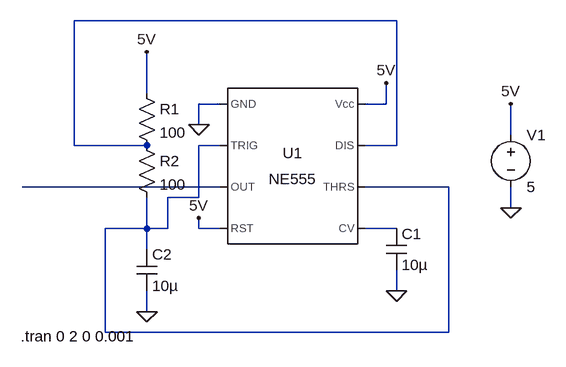
[diagram p0: schematic 555Sweep.asc]
555Sweep.asc, the LTspice schematic file:
Version 4
SHEET 1 880 680
WIRE 416 -64 -80 -64
WIRE 32 48 32 -16
WIRE 144 64 112 64
WIRE 400 64 400 32
WIRE 400 64 368 64
WIRE 112 96 112 64
WIRE 592 112 592 64
WIRE -80 128 -80 -64
WIRE 32 128 -80 128
WIRE 144 128 112 128
WIRE 416 128 416 -64
WIRE 416 128 368 128
WIRE 144 192 -160 192
WIRE 496 192 368 192
WIRE 112 208 112 128
WIRE 112 208 64 208
WIRE 592 224 592 192
WIRE 32 256 32 208
WIRE 32 256 -32 256
WIRE 64 256 64 208
WIRE 64 256 32 256
WIRE 112 256 112 240
WIRE 144 256 112 256
WIRE 416 256 368 256
WIRE 32 288 32 256
WIRE 416 352 416 320
WIRE 32 384 32 352
WIRE -32 416 -32 256
WIRE 496 416 496 192
WIRE 496 416 -32 416
FLAG 416 352 0
FLAG 112 96 0
FLAG 32 384 0
FLAG 592 64 5V
FLAG 400 32 5V
FLAG 112 240 5V
FLAG 592 224 0
FLAG 32 -16 5V
SYMBOL Misc\\NE555 256 160 R0
SYMATTR InstName U1
SYMBOL cap 400 256 R0
SYMATTR InstName C1
SYMATTR Value 10µ
SYMBOL cap 16 288 R0
SYMATTR InstName C2
SYMATTR Value 10µ
SYMBOL res 16 32 R0
SYMATTR InstName R1
SYMATTR Value 100
SYMBOL voltage 592 96 R0
WINDOW 123 0 0 Left 0
WINDOW 39 0 0 Left 0
SYMATTR InstName V1
SYMATTR Value 5
SYMBOL res 16 112 R0
SYMATTR InstName R2
SYMATTR Value 100
TEXT -162 422 Left 2 !.tran 0 2 0 0.001

The netlist it stands for:
* 555Sweep.asc
XU1 0 N002 N003 5V N004 N002 N001 5V NE555  ; pins GND TRIG OUT RST CV THRS DIS Vcc
C1 N004 0 10µ
C2 N002 0 10µ
R1 5V N001 100
V1 5V 0 5
R2 N001 N002 100
.tran 0 2 0 0.001
.lib NE555.sub
.backanno
.end